# EAGLE board alf_board_v8 (EAGLE 6.3)
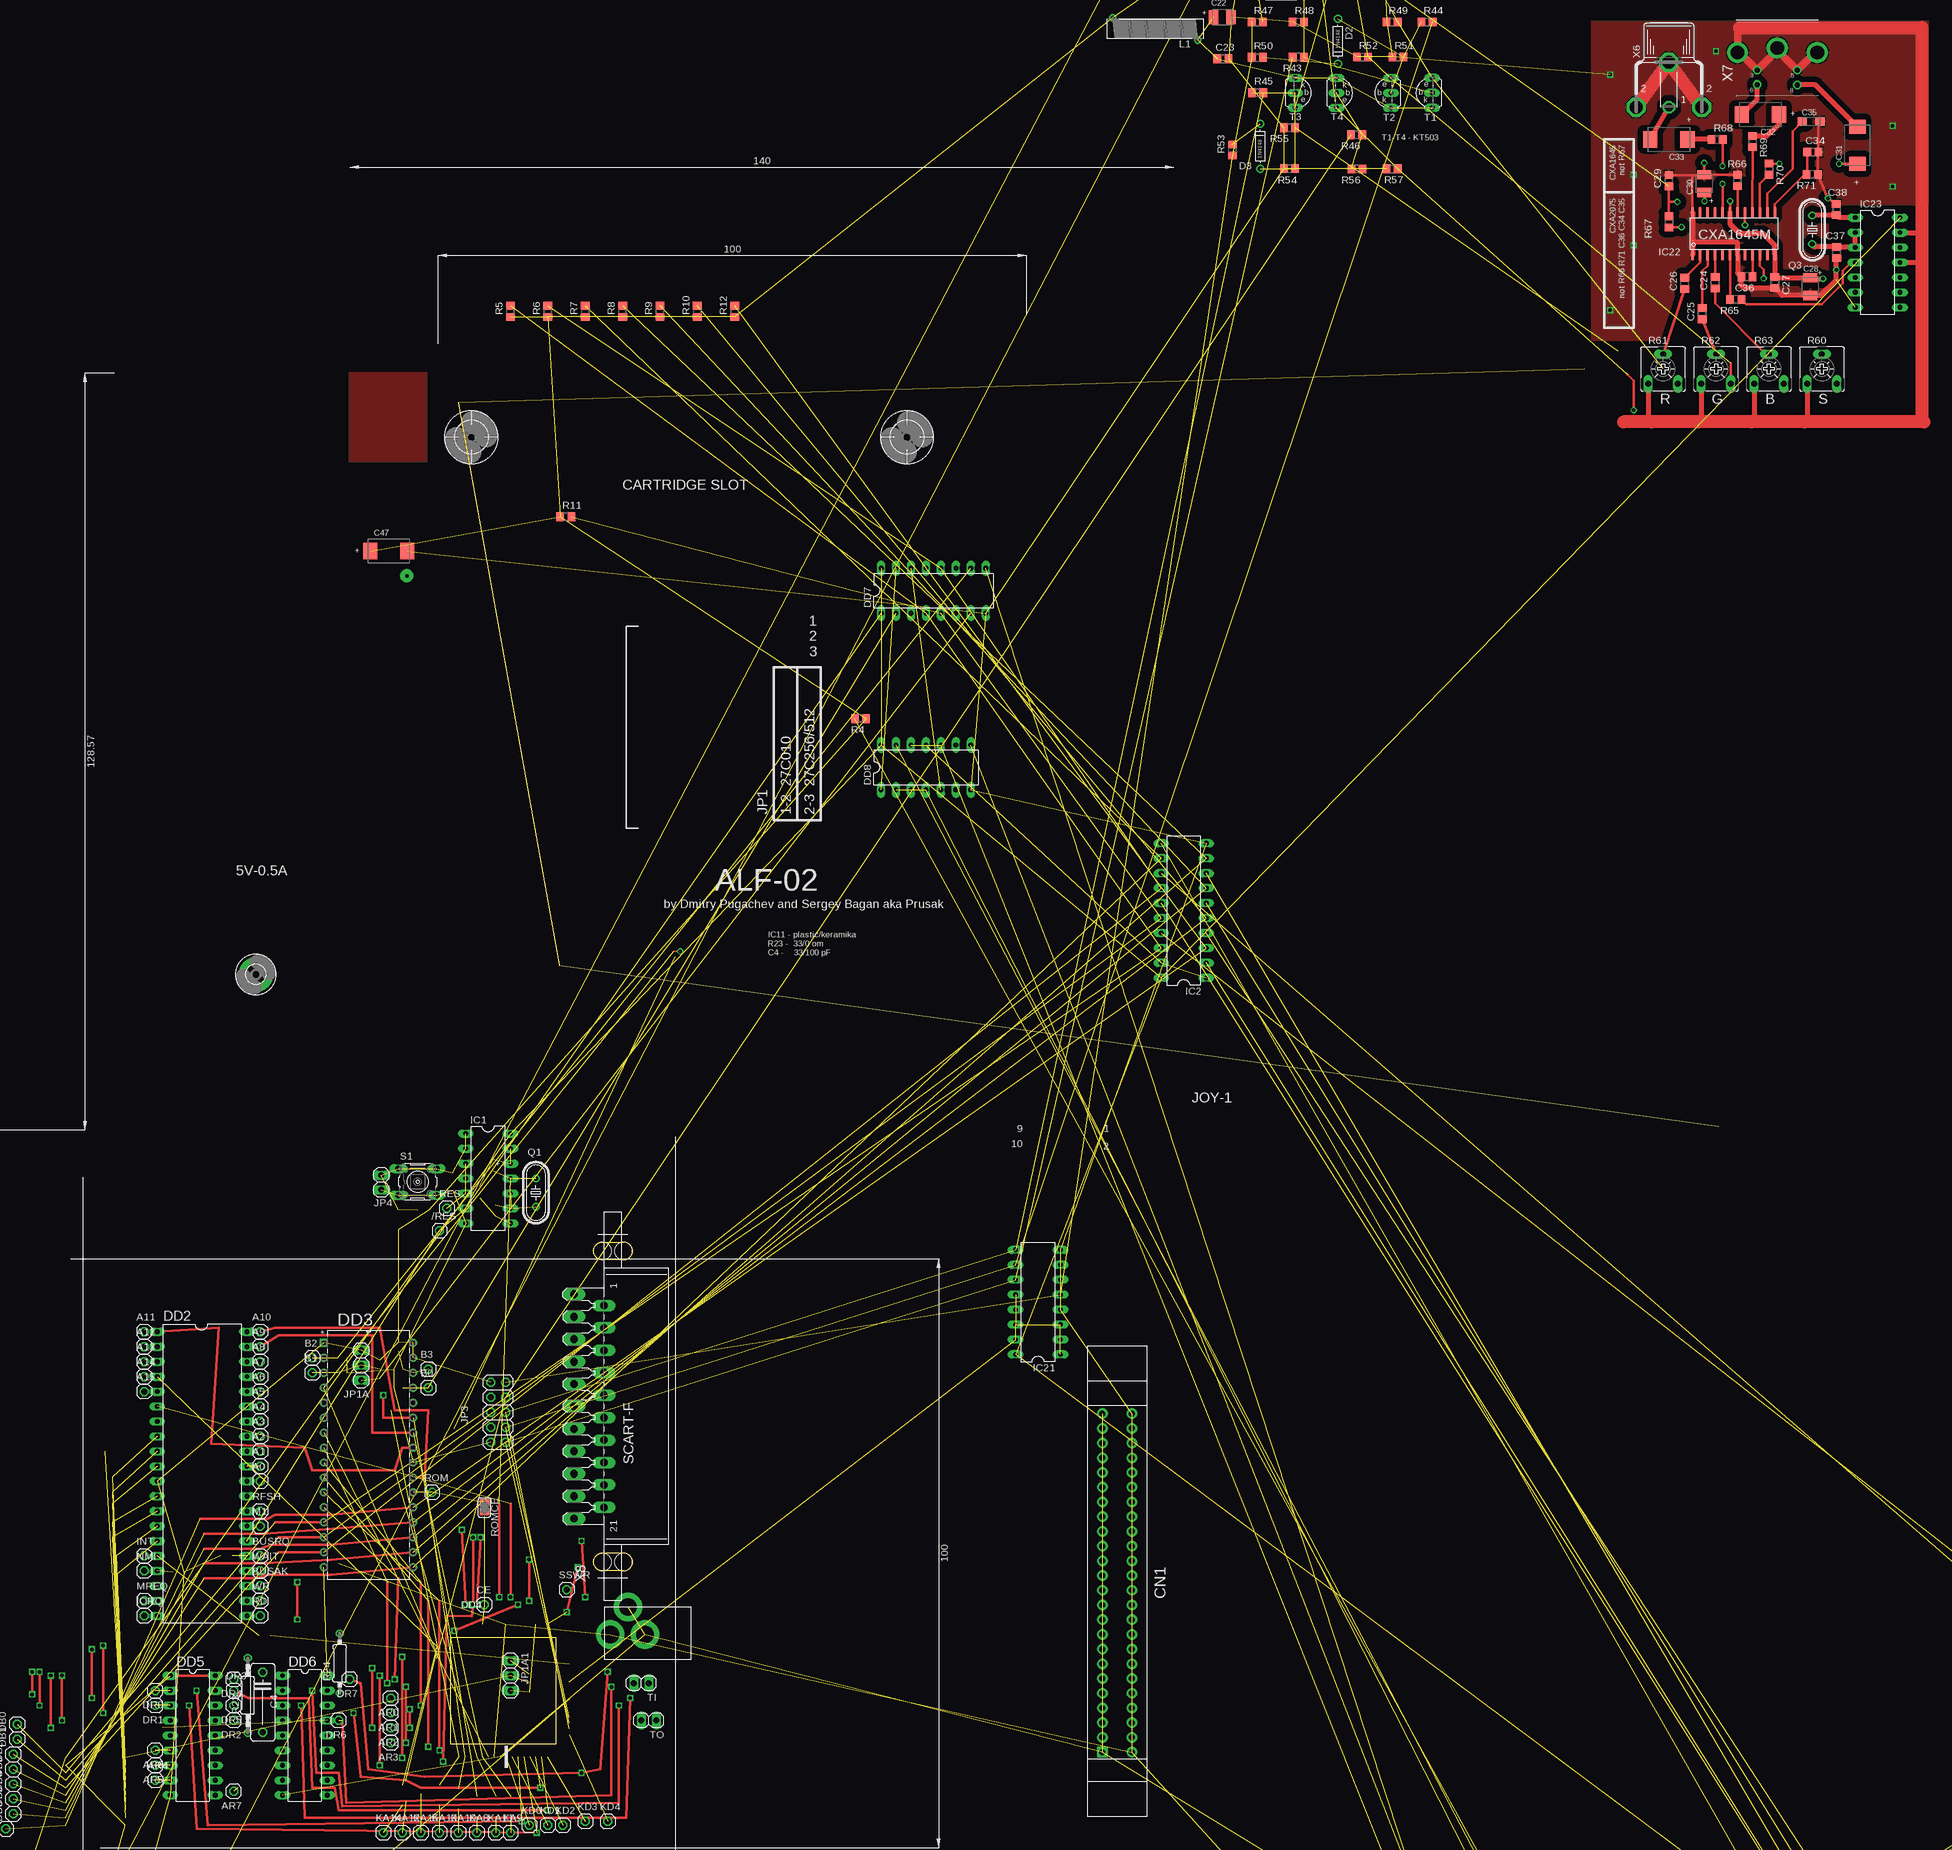
[diagram p5: board, top side]
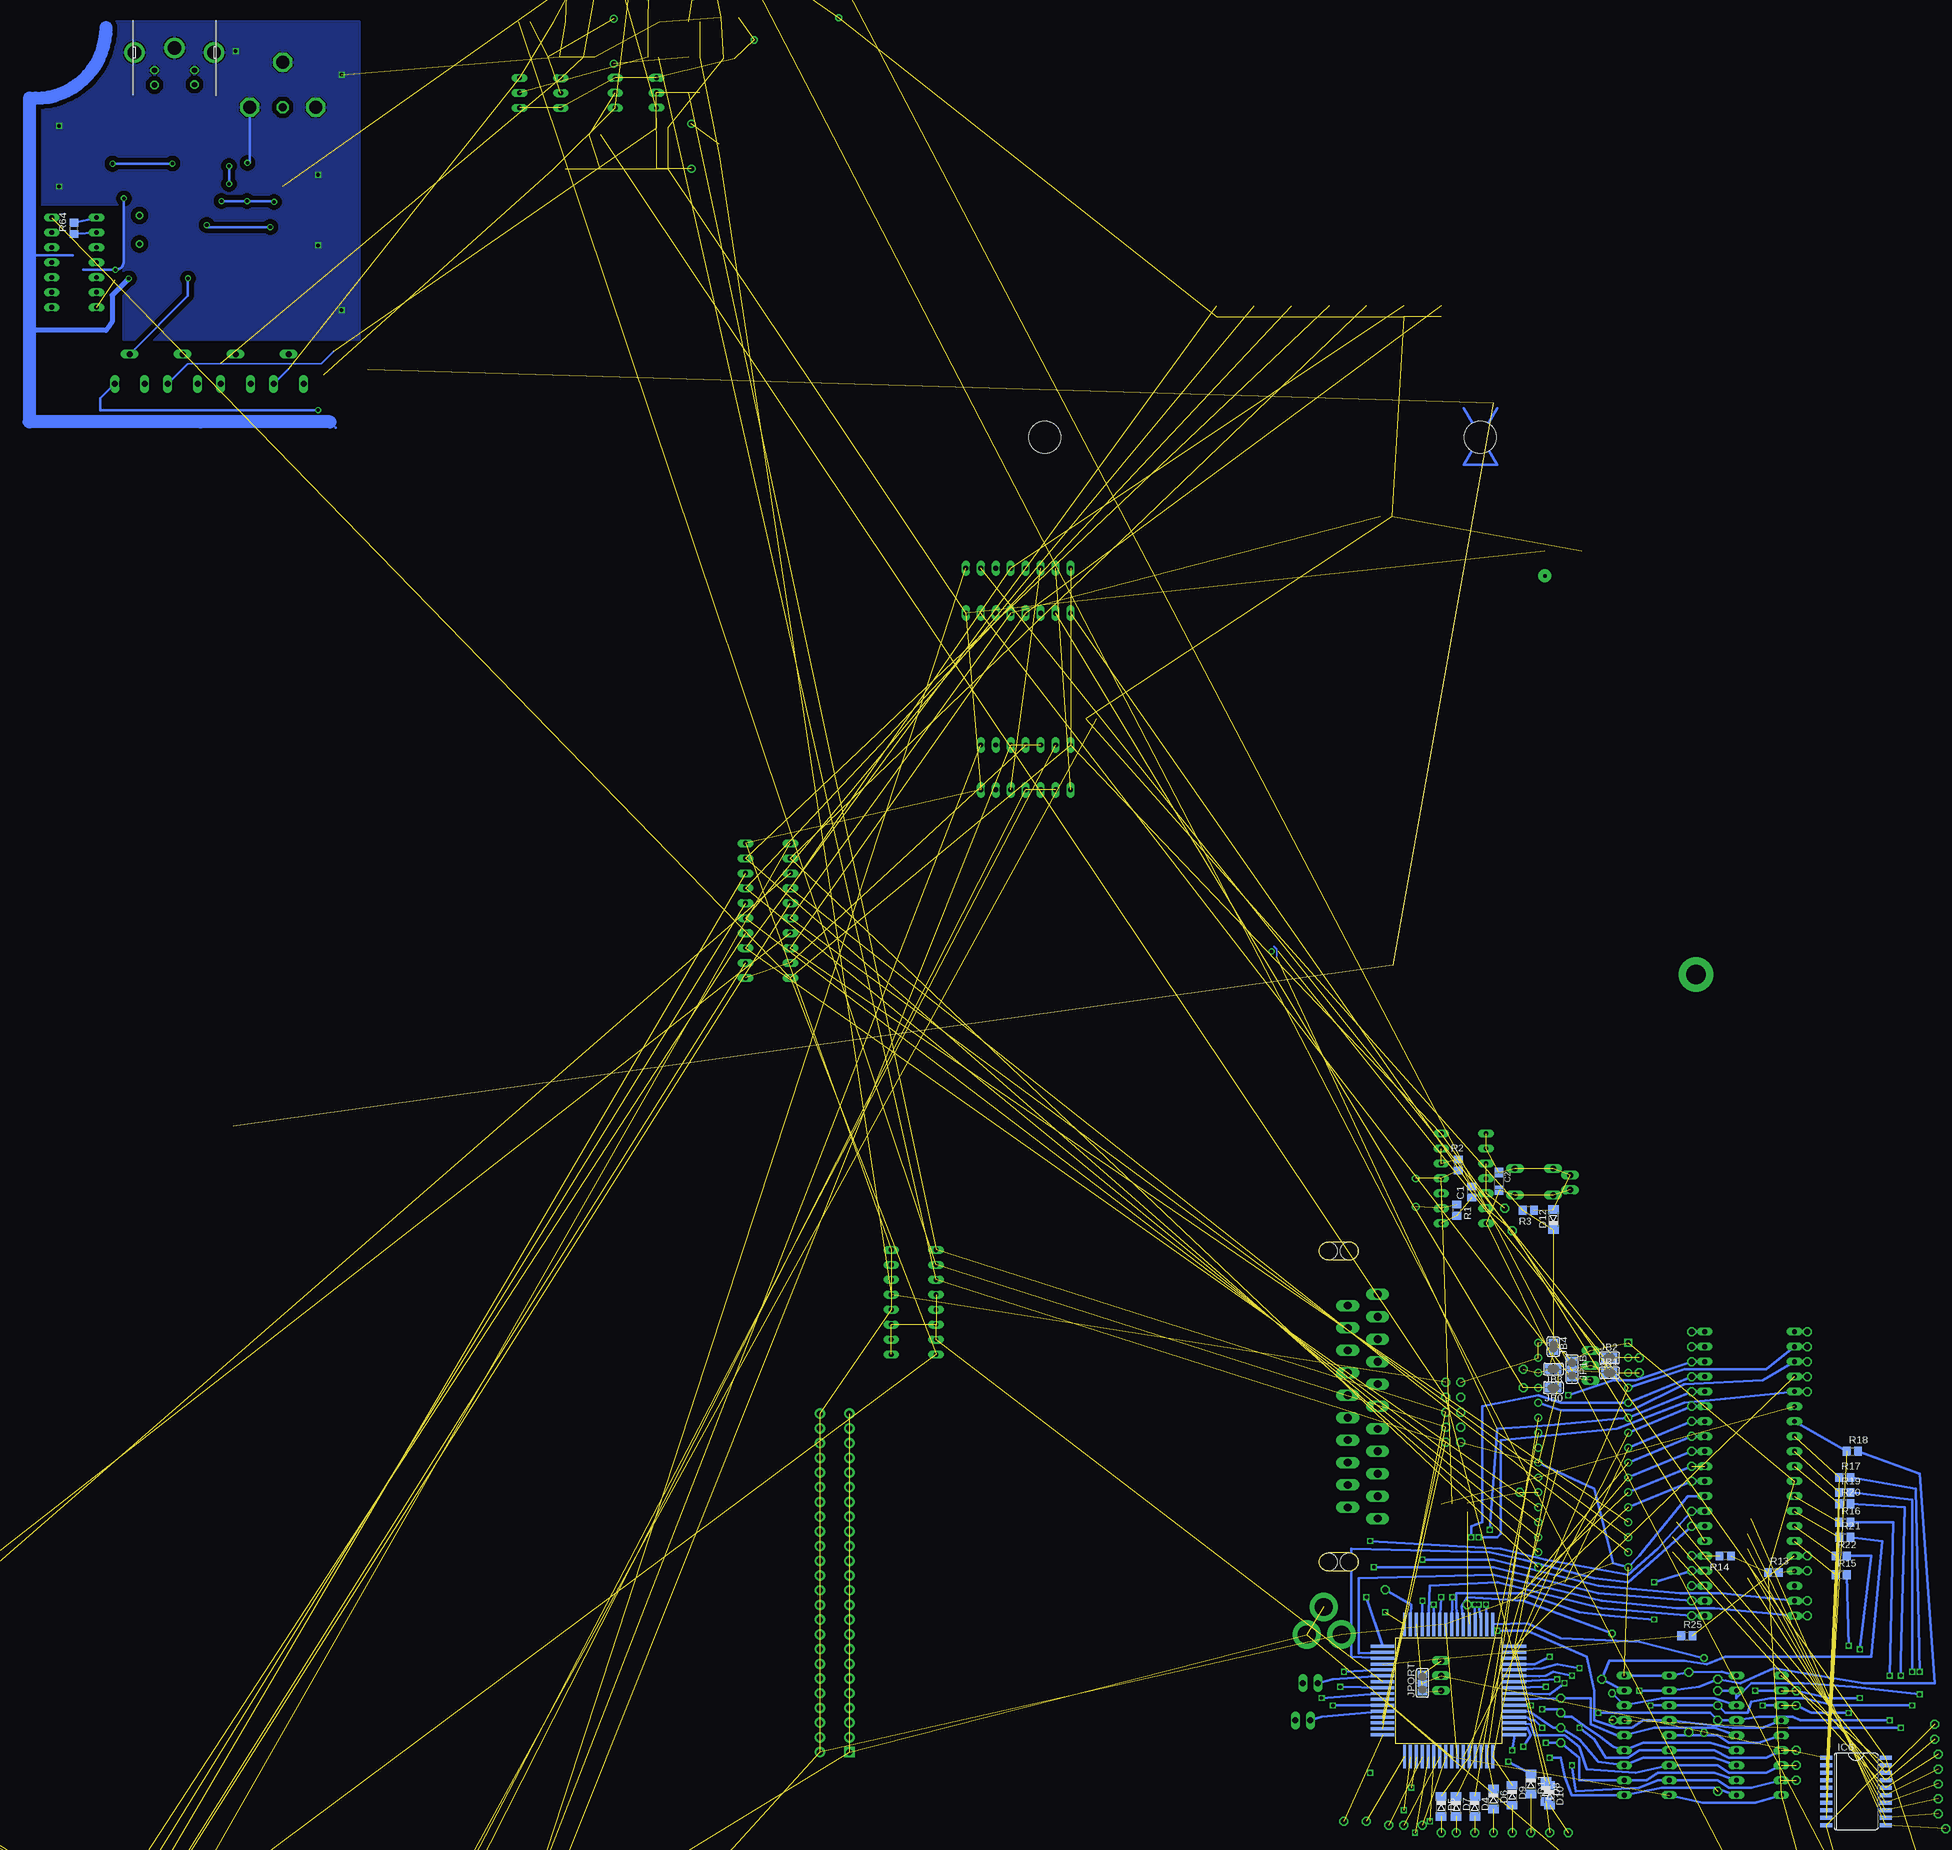
[diagram p6: board, bottom side, seen from below]

Size 215.5 x 233.45 mm. Coordinates in mm from the lower left corner, seen from the top.
Outline: 215.5,104.88 18.53,132.19 1.38,227.74 192.65,233.45
Copper layers (1*16): Top 0.035mm / dielectric 1.5mm / Bottom 0.035mm
Design rules "default *": minimum track width 10mil, minimum drill 24mil, track to track 8mil, track to pad 8mil, pad to pad 8mil, via to via 8mil, smd to smd 8mil, copper to edge 4mil, drill to drill 8mil, minimum pad ring 10mil, minimum via ring 8mil, stop-mask expansion 4mil, vias tented up to drill 24mil, thermal gap 10mil

## Footprints (pad centres in the part's own frame; a part is rotated, then mirrored left to right if it is on the bottom)
1X01 = drill 1.016 octagon: 1 0,0
C0805 = smd 1.3 x 1.5: 1 -0.95,0; 2 0.95,0
SMC_A = smd 1.6 x 1.4: + -1.5,0; - 1.5,0
C102-043X133 = drill 1.016 octagon: 1 -5.08,0; 2 5.08,0
SMC_B = smd 1.6 x 2.4: + -1.5,0; - 1.5,0
SMC_D = smd 2.4 x 2.8: + -3.15,0; - 3.15,0
СНП15-48 = drill 1 pad 1.778 square: 1 29,-2.5 | drill 1 pad 1.778: 2 29,2.5; 3 26.5,-2.5; 4 26.5,2.5; 5 24,-2.5; 6 24,2.5; 7 21.5,-2.5; 8 21.5,2.5; 9 19,-2.5; 10 19,2.5; 11 16.5,-2.5; 12 16.5,2.5; 13 14,-2.5; 14 14,2.5; 15 11.5,-2.5; 16 11.5,2.5; 17 9,-2.5; 18 9,2.5; 19 6.5,-2.5; 20 6.5,2.5; 21 4,-2.5; 22 4,2.5; 23 1.5,-2.5; 24 1.5,2.5; 25 -1,-2.5; 26 -1,2.5; 27 -3.5,-2.5; 28 -3.5,2.5; 29 -6,-2.5; 30 -6,2.5; 31 -8.5,-2.5; 32 -8.5,2.5; 33 -11,-2.5; 34 -11,2.5; 35 -13.5,-2.5; 36 -13.5,2.5; 37 -16,-2.5; 38 -16,2.5; 39 -18.5,-2.5; 40 -18.5,2.5; 41 -21,-2.5; 42 -21,2.5; 43 -23.5,-2.5; 44 -23.5,2.5; 45 -26,-2.5; 46 -26,2.5; 47 -28.5,-2.5; 48 -28.5,2.5
DO-1N4148 = drill 0.9: A -3.81,0; C 3.81,0
SOD80C = smd 1.4 x 1.8: A 1.7,0; C -1.7,0
DIL14 = drill 0.813 long: 1 -7.62,-3.81; 2 -5.08,-3.81; 3 -2.54,-3.81; 4 0,-3.81; 5 2.54,-3.81; 6 5.08,-3.81; 7 7.62,-3.81; 8 7.62,3.81; 9 5.08,3.81; 10 2.54,3.81; 11 0,3.81; 12 -2.54,3.81; 13 -5.08,3.81; 14 -7.62,3.81
DIL40 = drill 0.813 long: 1 -24.13,-7.62; 2 -21.59,-7.62; 3 -19.05,-7.62; 4 -16.51,-7.62; 5 -13.97,-7.62; 6 -11.43,-7.62; 7 -8.89,-7.62; 8 -6.35,-7.62; 9 -3.81,-7.62; 10 -1.27,-7.62; 11 1.27,-7.62; 12 3.81,-7.62; 13 6.35,-7.62; 14 8.89,-7.62; 15 11.43,-7.62; 16 13.97,-7.62; 17 16.51,-7.62; 18 19.05,-7.62; 19 21.59,-7.62; 20 24.13,-7.62; 21 24.13,7.62; 22 21.59,7.62; 23 19.05,7.62; 24 16.51,7.62; 25 13.97,7.62; 26 11.43,7.62; 27 8.89,7.62; 28 6.35,7.62; 29 3.81,7.62; 30 1.27,7.62; 31 -1.27,7.62; 32 -3.81,7.62; 33 -6.35,7.62; 34 -8.89,7.62; 35 -11.43,7.62; 36 -13.97,7.62; 37 -16.51,7.62; 38 -19.05,7.62; 39 -21.59,7.62; 40 -24.13,7.62
DIP254P1524X482-32P = drill 0.838 square: 1 -15.24,38.1 | drill 0.838: 2 -15.24,35.56; 3 -15.24,33.02; 4 -15.24,30.48; 5 -15.24,27.94; 6 -15.24,25.4; 7 -15.24,22.86; 8 -15.24,20.32; 9 -15.24,17.78; 10 -15.24,15.24; 11 -15.24,12.7; 12 -15.24,10.16; 13 -15.24,7.62; 14 -15.24,5.08; 15 -15.24,2.54; 16 -15.24,0; 17 0,0; 18 0,2.54; 19 0,5.08; 20 0,7.62; 21 0,10.16; 22 0,12.7; 23 0,15.24; 24 0,17.78; 25 0,20.32; 26 0,22.86; 27 0,25.4; 28 0,27.94; 29 0,30.48; 30 0,33.02; 31 0,35.56; 32 0,38.1
TQFP64-MF = smd 0.5 x 4 bottom: 1 0.5,-11.225; 2 1.5,-11.225; 3 2.5,-11.225; 4 3.5,-11.225; 5 4.5,-11.225; 6 5.5,-11.225; 7 6.5,-11.225; 8 7.5,-11.225; 25 7.5,11.225; 26 6.5,11.225; 27 5.5,11.225; 28 4.5,11.225; 29 3.5,11.225; 30 2.5,11.225; 31 1.5,11.225; 32 0.5,11.225; 33 -0.5,11.225; 34 -1.5,11.225; 35 -2.5,11.225; 36 -3.5,11.225; 37 -4.5,11.225; 38 -5.5,11.225; 39 -6.5,11.225; 40 -7.5,11.225; 57 -7.5,-11.225; 58 -6.5,-11.225; 59 -5.5,-11.225; 60 -4.5,-11.225; 61 -3.5,-11.225; 62 -2.5,-11.225; 63 -1.5,-11.225; 64 -0.5,-11.225 | smd 4 x 0.5 bottom: 9 11.225,-7.5; 10 11.225,-6.5; 11 11.225,-5.5; 12 11.225,-4.5; 13 11.225,-3.5; 14 11.225,-2.5; 15 11.225,-1.5; 16 11.225,-0.5; 17 11.225,0.5; 18 11.225,1.5; 19 11.225,2.5; 20 11.225,3.5; 21 11.225,4.5; 22 11.225,5.5; 23 11.225,6.5; 24 11.225,7.5; 41 -11.225,7.5; 42 -11.225,6.5; 43 -11.225,5.5; 44 -11.225,4.5; 45 -11.225,3.5; 46 -11.225,2.5; 47 -11.225,1.5; 48 -11.225,0.5; 49 -11.225,-0.5; 50 -11.225,-1.5; 51 -11.225,-2.5; 52 -11.225,-3.5; 53 -11.225,-4.5; 54 -11.225,-5.5; 55 -11.225,-6.5; 56 -11.225,-7.5
DIL18 = drill 0.813 long: 1 -10.16,-3.81; 2 -7.62,-3.81; 3 -5.08,-3.81; 4 -2.54,-3.81; 5 0,-3.81; 6 2.54,-3.81; 7 5.08,-3.81; 8 7.62,-3.81; 9 10.16,-3.81; 10 10.16,3.81; 11 7.62,3.81; 12 5.08,3.81; 13 2.54,3.81; 14 0,3.81; 15 -2.54,3.81; 16 -5.08,3.81; 17 -7.62,3.81; 18 -10.16,3.81
DIL16 = drill 0.813 long: 1 -8.89,-3.81; 2 -6.35,-3.81; 3 -3.81,-3.81; 4 -1.27,-3.81; 5 1.27,-3.81; 6 3.81,-3.81; 7 6.35,-3.81; 8 8.89,-3.81; 9 8.89,3.81; 10 6.35,3.81; 11 3.81,3.81; 12 1.27,3.81; 13 -1.27,3.81; 14 -3.81,3.81; 15 -6.35,3.81; 16 -8.89,3.81
3,3-PAD = drill 3.3 pad 5.842: B3,3 0,0
DIL20 = drill 0.813 long: 1 -11.43,-3.81; 2 -8.89,-3.81; 3 -6.35,-3.81; 4 -3.81,-3.81; 5 -1.27,-3.81; 6 1.27,-3.81; 7 3.81,-3.81; 8 6.35,-3.81; 9 8.89,-3.81; 10 11.43,-3.81; 11 11.43,3.81; 12 8.89,3.81; 13 6.35,3.81; 14 3.81,3.81; 15 1.27,3.81; 16 -1.27,3.81; 17 -3.81,3.81; 18 -6.35,3.81; 19 -8.89,3.81; 20 -11.43,3.81
SO20W = smd 0.66 x 2.032: 1 -5.715,-5.029; 2 -4.445,-5.029; 3 -3.175,-5.029; 4 -1.905,-5.029; 5 -0.635,-5.029; 6 0.635,-5.029; 7 1.905,-5.029; 8 3.175,-5.029; 9 4.445,-5.029; 10 5.715,-5.029; 11 5.715,5.029; 12 4.445,5.029; 13 3.175,5.029; 14 1.905,5.029; 15 0.635,5.029; 16 -0.635,5.029; 17 -1.905,5.029; 18 -3.175,5.029; 19 -4.445,5.029; 20 -5.715,5.029
SOP24 = smd 0.45 x 1.8: 1 -6.97,-3.6; 2 -5.7,-3.6; 3 -4.43,-3.6; 4 -3.16,-3.6; 5 -1.89,-3.6; 6 -0.62,-3.6; 7 0.65,-3.6; 8 1.92,-3.6; 9 3.19,-3.6; 10 4.46,-3.6; 11 5.73,-3.6; 12 7,-3.6; 13 7,3.6; 14 5.73,3.6; 15 4.46,3.6; 16 3.19,3.6; 17 1.92,3.6; 18 0.65,3.6; 19 -0.62,3.6; 20 -1.89,3.6; 21 -3.16,3.6; 22 -4.43,3.6; 23 -5.7,3.6; 24 -6.97,3.6
PJ-102A = drill 3 pad 4.8: RING 0.1,-3.39; RING_SW -4.6,-6.29; TIP 0.1,-9.29
SJ = smd 1.168 x 1.6: 1 -0.762,0; 2 0.762,0
1X03 = drill 1.016 long: 1 -2.54,0; 2 0,0; 3 2.54,0
SJ_2 = smd 1.168 x 1.6: 1 -1.524,0; 2 0,0; 3 1.524,0
2X05 = drill 1.016 octagon: 1 -5.08,-1.27; 2 -5.08,1.27; 3 -2.54,-1.27; 4 -2.54,1.27; 5 0,-1.27; 6 0,1.27; 7 2.54,-1.27; 8 2.54,1.27; 9 5.08,-1.27; 10 5.08,1.27
1X02 = drill 1.016 long: 1 -1.27,0; 2 1.27,0
Z27/24 = drill 0.7 octagon: 1 7.2,-1.9; 2 -7.2,1.9
HC49/S = drill 0.813: 1 -2.413,0; 2 2.413,0
R0805 = smd 1.3 x 1.5: 1 -0.95,0; 2 0.95,0
0207/12 = drill 0.813 octagon: 1 -6.35,0; 2 6.35,0
0207/10 = drill 0.813 octagon: 1 -5.08,0; 2 5.08,0
CA6V = drill 1.016 long: A -2.54,-2.54; E 2.54,-2.54; S 0,2.54
B3F-10XX = drill 1.016 long: 1 -3.251,2.261; 2 3.251,2.261; 3 -3.251,-2.261; 4 3.251,-2.261
TO92-CBE = drill 0.813 long: B 0,0; C -2.54,0; E 2.54,0
5,5 = hole 5.5: 0,0
TOBU3 = drill 1.397 octagon: 1 0,-2.54 | drill 2.21 octagon: 2 5.588,-2.54; 2@1 -5.588,-2.54; 2@2 0,5.08
H5M09RA = drill 1.092: 1 -5.537,1.422; 2 -2.769,1.422; 3 0,1.422; 4 2.769,1.422; 5 5.537,1.422; 6 -4.153,-1.422; 7 -1.384,-1.422; 8 1.384,-1.422; 9 4.153,-1.422 | hole 3.048: -12.497,0; 12.497,0
M15HP = drill 1.016 octagon: 1 -9.601,1.27; 2 -6.858,1.27; 3 -4.115,1.27; 4 -1.372,1.27; 5 1.372,1.27; 6 4.115,1.27; 7 6.858,1.27; 8 9.601,1.27; 9 -8.23,-1.27; 10 -5.486,-1.27; 11 -2.743,-1.27; 12 0,-1.27; 13 2.743,-1.27; 14 5.486,-1.27; 15 8.23,-1.27 | drill 3.302 pad 5.08: G1 -16.662,0; G2 16.662,0
M_DIN4 = drill 0.9 pad 1.422 octagon: 3 -3.4,-3.75; 5 3.4,-3.75; 6 -3.4,-6.2; 8 3.4,-6.25 | drill 2.3 pad 3.5: SH1 6.8,-0.75; SH2 0,0.05; SH3 -6.75,-0.75
SCART-F = drill 1.321 long: 1 19.05,5.08; 2 17.145,0; 3 15.24,5.08; 4 13.335,0; 5 11.43,5.08; 6 9.525,0; 7 7.62,5.08; 8 5.715,0; 9 3.81,5.08; 10 1.905,0; 11 0,5.08; 12 -1.905,0; 13 -3.81,5.08; 14 -5.715,0; 15 -7.62,5.08; 16 -9.525,0; 17 -11.43,5.08; 18 -13.335,0; 19 -15.24,5.08; 20 -17.145,0; 21 -19.05,5.08 | hole 3.023: 26.416,0.254; 26.416,-3.302; -26.416,0.254; -26.416,-3.302

## Placement (x,y rotation side)
/RES  [1X01]  -1.79,87.1 0 top
A0  [1X01]  -32.27,44.56 0 top  (outside the outline)
A1  [1X01]  -32.27,47.1 0 top  (outside the outline)
A2  [1X01]  -32.27,49.64 0 top  (outside the outline)
A3  [1X01]  -32.27,52.18 0 top  (outside the outline)
A4  [1X01]  -32.27,54.72 0 top  (outside the outline)
A5  [1X01]  -32.27,57.26 0 top  (outside the outline)
A6  [1X01]  -32.27,59.8 0 top  (outside the outline)
A7  [1X01]  -32.27,62.34 0 top  (outside the outline)
A8  [1X01]  -32.27,64.88 0 top  (outside the outline)
A9  [1X01]  -32.27,67.42 0 top  (outside the outline)
A10  [1X01]  -32.27,69.96 0 top  (outside the outline)
A11  [1X01]  -51.96,69.96 0 top  (outside the outline)
A12  [1X01]  -51.96,67.42 0 top  (outside the outline)
A13  [1X01]  -51.96,64.88 0 top  (outside the outline)
A14  [1X01]  -51.96,62.34 0 top  (outside the outline)
A15  [1X01]  -51.96,59.8 0 top  (outside the outline)
AR0  [1X01]  -10.05,7.73 180 top  (outside the outline)
AR1  [1X01]  -10.05,5.19 180 top  (outside the outline)
AR2  [1X01]  -10.05,2.65 180 top  (outside the outline)
AR3  [1X01]  -10.05,0.11 180 top  (outside the outline)
AR4  [1X01]  -50.06,-6.24 0 top  (outside the outline)
AR5  [1X01]  -50.06,-3.7 180 top  (outside the outline)
AR6  [1X01]  -50.06,-1.16 180 top  (outside the outline)
AR7  [1X01]  -36.72,-8.15 180 top  (outside the outline)
B0  [1X01]  -3.7,60.43 0 top  (outside the outline)
B1  [1X01]  -23.38,62.97 0 top  (outside the outline)
B2  [1X01]  -23.38,65.51 0 top  (outside the outline)
B3  [1X01]  -3.7,63.61 0 top  (outside the outline)
BUSAK  [1X01]  -32.27,26.78 0 top  (outside the outline)
BUSRQ  [1X01]  -32.27,31.86 0 top  (outside the outline)
C1  68pF  [C0805]  5.07,93.7 90 bottom
C2  10uF 16V  [SMC_A]  0.43,95.48 270 bottom
C4  33/100pF  [C102-043X133]  -31.81,7.01 270 top  (outside the outline)
C5  [C0805]  -87.22,-92.05 180 bottom  (outside the outline)
C6  68pF  [C0805]  -97.09,-126.12 270 top  (outside the outline)
C7  1uF  [SMC_A]  -62.77,-68.52 90 top  (outside the outline)
C8  1uF  [SMC_A]  -80.42,-68.54 90 top  (outside the outline)
C22  100uF  [SMC_B]  131.19,293.25 0 top  (outside the outline)
C23  [C0805]  131.3,286.22 0 top  (outside the outline)
C24  [C0805]  214.91,248.16 90 top  (outside the outline)
C25  [C0805]  212.72,242.91 90 top  (outside the outline)
C26  [C0805]  209.77,248.06 90 top  (outside the outline)
C27  [C0805]  225.06,248.21 270 top  (outside the outline)
C28  47uF  [SMC_B]  231.06,247.51 270 top  (outside the outline)
C29  [C0805]  207.06,265.51 90 top  (outside the outline)
C30  47uF  [SMC_B]  213.06,265.01 90 top  (outside the outline)
C31  220uF  [SMC_D]  239.07,271.51 90 top  (outside the outline)
C32  220uF  [SMC_D]  222.62,276.76 180 top  (outside the outline)
C33  220uF  [SMC_D]  207.06,272.51 180 top  (outside the outline)
C34  [C0805]  231.52,270.36 0 top  (outside the outline)
C35  10uF  [SMC_A]  231.22,275.56 0 top  (outside the outline)
C36  [C0805]  220.31,249.16 180 top  (outside the outline)
C37  33  [C0805]  235.56,253.31 90 top  (outside the outline)
C38  33  [C0805]  235.52,260.61 270 top  (outside the outline)
C39  4n7  [C0805]  309.91,-10.78 0 top  (outside the outline)
C40  [C0805]  345.96,-20.18 270 top  (outside the outline)
C41  50uF  [SMC_B]  339.96,-20.18 270 top  (outside the outline)
C42  [C0805]  304.96,-20.18 270 top  (outside the outline)
C43  50uF  [SMC_B]  297.96,-20.18 270 top  (outside the outline)
C47  220uF  [SMC_D]  -10.44,202.57 0 top  (outside the outline)
CE  [1X01]  5.82,23.6 0 top
CN1  СНП15-48  [СНП15-48]  113.31,27.54 270 top
D1  1N4148  [DO-1N4148]  141.21,296.9 180 top  (outside the outline)
D2  1N4148  [DO-1N4148]  150.83,289.19 270 top  (outside the outline)
D3  1N4148  [DO-1N4148]  137.63,271.35 90 top  (outside the outline)
D4  LL4148  [SOD80C]  4.55,-10.69 270 bottom  (outside the outline)
D5  LL4148  [SOD80C]  10.27,-10.69 270 bottom  (outside the outline)
D6  LL4148  [SOD80C]  1.38,-9.42 270 bottom  (outside the outline)
D7  LL4148  [SOD80C]  7.73,-10.69 270 bottom  (outside the outline)
D8  LL4148  [SOD80C]  -7.51,-8.15 270 bottom  (outside the outline)
D9  LL4148  [SOD80C]  -1.79,-8.78 270 bottom  (outside the outline)
D10  LL4148  [SOD80C]  -8.14,-8.78 270 bottom  (outside the outline)
D11  LL4148  [SOD80C]  -4.97,-6.88 270 bottom  (outside the outline)
D12  LL4148  [SOD80C]  -8.78,89.01 90 bottom  (outside the outline)
DB0  [1X01]  -73.55,3.28 90 top  (outside the outline)
DB1  [1X01]  -73.55,0.74 90 top  (outside the outline)
DB2  [1X01]  -74.19,-1.8 90 top  (outside the outline)
DB3  [1X01]  -74.19,-4.34 90 top  (outside the outline)
DB4  [1X01]  -74.19,-6.88 90 top  (outside the outline)
DB5  [1X01]  -74.19,-9.42 90 top  (outside the outline)
DB6  [1X01]  -74.19,-11.96 90 top  (outside the outline)
DB7  [1X01]  -75.45,-14.5 90 top  (outside the outline)
DD1  LS04/1533LN1  [DIL14]  166.37,-45.41 270 top  (outside the outline)
DD2  Z80  [DIL40]  -42.12,45.83 270 top  (outside the outline)
DD3  27C010  [DIP254P1524X482-32P]  -6.24,29.95 0 top  (outside the outline)
DD4  Т34ВГ1  [TQFP64-MF]  9,9 0 top
DD5  41464/RU11  [DIL18]  -43.7,1.38 270 top  (outside the outline)
DD6  41464/RU11  [DIL18]  -24.66,1.38 270 top  (outside the outline)
DD7  ALS175/1533TM8  [DIL16]  82.12,195.84 0 top
DD8  ALS32/1533LL1  [DIL14]  80.84,165.82 0 top
DR0  [1X01]  -50.06,9 180 top  (outside the outline)
DR1  [1X01]  -50.06,6.46 180 top  (outside the outline)
DR2  [1X01]  -36.72,3.92 180 top  (outside the outline)
DR3  [1X01]  -36.72,9 0 top  (outside the outline)
DR4  [1X01]  -36.72,10.9 180 top  (outside the outline)
DR5  [1X01]  -36.72,6.46 180 top  (outside the outline)
DR6  [1X01]  -18.94,3.92 180 top  (outside the outline)
DR7  [1X01]  -17.04,10.9 180 top  (outside the outline)
H1  MOUNT-PAD-ROUND3.3  [3,3-PAD]  -32.99,130.66 0 top  (outside the outline)
IC1  74HC00N  [DIL14]  6.46,95.99 270 top
IC2  ALS240 / 1533AP3  [DIL20]  124.64,141.49 90 top
IC5  ALS09/1533LI2  [DIL14]  216.75,-86.59 0 top  (outside the outline)
IC6  LS245 / 555AP6  [SO20W]  -60.22,-8.15 270 bottom  (outside the outline)
IC12  YM2149F / AY-3-8910  [DIL40]  -72.47,-126.66 270 top  (outside the outline)
IC13  ALS138/1533ID7  [DIL16]  -109.9,-135.84 270 top  (outside the outline)
IC14  ALS00/1533LA3  [DIL14]  -93.08,-141.3 270 top  (outside the outline)
IC16  ALS93/1533IE5  [DIL14]  -90.26,-116.46 90 top  (outside the outline)
IC17  74HC595  [DIL16]  334.64,-6.84 0 top  (outside the outline)
IC18  74HC595  [DIL16]  231,-37.28 180 top  (outside the outline)
IC19  7493 / 155IE5  [DIL14]  365.22,-11.59 270 top  (outside the outline)
IC20  ALS04/1533LN1  [DIL14]  296.06,-1.3 270 top  (outside the outline)
IC21  ALS251/1533KP15  [DIL16]  99.89,74.98 90 top
IC22  CXA1645  [SOP24]  218.06,256.51 0 top  (outside the outline)
IC23  74HCT04  [DIL14]  242.52,251.61 270 top  (outside the outline)
INT  [1X01]  -51.96,31.86 0 top  (outside the outline)
IORQ  [1X01]  -51.96,21.7 0 top  (outside the outline)
J1  2.1MMJACKTHM  [PJ-102A]  36.5,18.61 270 top
JB0  [SJ]  -8.78,60.43 180 bottom  (outside the outline)
JB1  [SJ]  -18.3,62.97 0 bottom  (outside the outline)
JB2  [SJ]  -18.3,65.51 0 bottom  (outside the outline)
JB3  [SJ]  -8.78,63.61 180 bottom  (outside the outline)
JB4  [SJ]  -8.78,67.42 270 bottom  (outside the outline)
JP1A  [1X03]  -15.1,64.24 90 top  (outside the outline)
JP1A1  [1X03]  10.27,11.54 270 top
JP1B  [SJ_2]  -11.96,63.61 270 bottom  (outside the outline)
JP3  V-TTL-OUT  [2X05]  8.2,56.27 90 top
JP4  RESET  [1X02]  -11.66,95.31 270 top  (outside the outline)
JPORT  [SJ_2]  13.45,10.27 90 bottom
KA8  [1X01]  4.55,-15.13 0 top  (outside the outline)
KA9  [1X01]  10.27,-15.13 0 top  (outside the outline)
KA10  [1X01]  1.38,-15.13 0 top  (outside the outline)
KA11  [1X01]  7.73,-15.13 0 top  (outside the outline)
KA12  [1X01]  -8.14,-15.13 0 top  (outside the outline)
KA13  [1X01]  -1.79,-15.13 0 top  (outside the outline)
KA14  [1X01]  -11.32,-15.13 0 top  (outside the outline)
KA15  [1X01]  -4.97,-15.13 0 top  (outside the outline)
KD0  [1X01]  13.45,-13.86 0 top  (outside the outline)
KD1  [1X01]  16.62,-13.86 0 top  (outside the outline)
KD2  [1X01]  19.16,-13.86 0 top  (outside the outline)
KD3  [1X01]  22.97,-13.23 0 top  (outside the outline)
KD4  [1X01]  26.78,-13.23 0 top  (outside the outline)
L1  220 uH  [Z27/24]  119.8,291.31 180 top  (outside the outline)
M1  [1X01]  -32.27,36.94 0 top  (outside the outline)
MREQ  [1X01]  -51.96,24.24 0 top  (outside the outline)
NMI  [1X01]  -51.96,29.32 0 top  (outside the outline)
PKD0  [1X01]  346.82,12.81 90 top  (outside the outline)
PKD1  [1X01]  331.58,12.81 90 top  (outside the outline)
PKD2  [1X01]  326.5,12.81 90 top  (outside the outline)
PKD3  [1X01]  336.66,12.81 90 top  (outside the outline)
PKD4  [1X01]  341.74,12.81 90 top  (outside the outline)
PKD6  [1X01]  351.9,12.81 90 top  (outside the outline)
Q1  8Mhz  [HC49/S]  14.59,93.59 90 top
Q2  14Mhz  [HC49/S]  -107.53,-118.94 0 top  (outside the outline)
Q3  4,433619Mhz  [HC49/S]  231.41,257.16 270 top  (outside the outline)
R1  510  [R0805]  7.65,90.6 270 bottom
R2  510  [R0805]  7.38,98.28 270 bottom
R3  100k  [R0805]  -4.53,90.58 180 bottom  (outside the outline)
R4  1.6k  [R0805]  69.73,174.1 180 top
R5  2.2k  [R0805]  10.27,243.31 90 top  (outside the outline)
R6  2.2k  [R0805]  16.62,243.31 90 top  (outside the outline)
R7  2.2k  [R0805]  22.97,243.31 90 top  (outside the outline)
R8  2.2k  [R0805]  29.32,243.31 90 top  (outside the outline)
R9  2.2k  [R0805]  35.67,243.31 90 top  (outside the outline)
R10  2.2k  [R0805]  42.02,243.31 90 top  (outside the outline)
R11  2.2k  [R0805]  19.65,208.41 0 top
R12  2.2k  [R0805]  48.37,243.31 90 top  (outside the outline)
R13  10k  [R0805]  -46.17,29.05 0 bottom  (outside the outline)
R14  10k  [R0805]  -37.99,31.86 180 bottom  (outside the outline)
R15  1k  [R0805]  -57.67,28.68 0 bottom  (outside the outline)
R16  1k  [R0805]  -58.31,37.57 0 bottom  (outside the outline)
R17  1k  [R0805]  -58.31,45.19 0 bottom  (outside the outline)
R18  1k  [R0805]  -59.58,49.64 0 bottom  (outside the outline)
R19  1k  [R0805]  -58.31,42.65 0 bottom  (outside the outline)
R20  1k  [R0805]  -58.31,40.75 0 bottom  (outside the outline)
R21  1k  [R0805]  -58.31,35.03 0 bottom  (outside the outline)
R22  1k  [R0805]  -57.67,31.86 0 bottom  (outside the outline)
R23  33/0  [0207/12]  -34.38,8.16 90 top  (outside the outline)
R24  33  [0207/10]  -18.75,13.61 90 top  (outside the outline)
R25  300  [R0805]  -31.48,18.28 0 bottom  (outside the outline)
R26  510  [R0805]  -89.58,-126.69 270 top  (outside the outline)
R27  510  [R0805]  -84.66,-130.25 270 top  (outside the outline)
R28  2.2k  [R0805]  -68.58,-63.93 0 top  (outside the outline)
R29  1k  [R0805]  -63.22,-75.25 270 top  (outside the outline)
R30  1k  [R0805]  -57.81,-75.24 270 top  (outside the outline)
R31  15k  [R0805]  -68.5,-69.34 270 top  (outside the outline)
R32  2.2k  [R0805]  -68.5,-75.29 270 top  (outside the outline)
R33  15k  [R0805]  -74.5,-69.34 270 top  (outside the outline)
R34  2.2k  [R0805]  -74.5,-75.29 270 top  (outside the outline)
R35  1k  [R0805]  -85.41,-75.29 270 top  (outside the outline)
R36  2.2k  [R0805]  -74.61,-63.92 180 top  (outside the outline)
R37  1k  [R0805]  -79.97,-75.25 270 top  (outside the outline)
R38  1k  [R0805]  -70.58,-93.69 270 top  (outside the outline)
R39  1.5k  [R0805]  304.96,-11.18 90 top  (outside the outline)
R40  10k  [R0805]  347.96,6.82 0 top  (outside the outline)
R41  1k  [R0805]  343.97,0.81 90 top  (outside the outline)
R42  10k  [R0805]  322.96,6.82 0 top  (outside the outline)
R43  1k  [R0805]  144.12,286.49 180 top  (outside the outline)
R44  1k  [R0805]  166,292.47 0 top  (outside the outline)
R45  1k  [R0805]  137.19,280.47 0 top  (outside the outline)
R46  1.5k  [R0805]  154.02,273.28 180 top  (outside the outline)
R47  3k3  [R0805]  137.15,292.47 0 top  (outside the outline)
R48  3k3  [R0805]  144.09,292.47 0 top  (outside the outline)
R49  200  [R0805]  160.05,292.47 0 top  (outside the outline)
R50  3k3  [R0805]  137.15,286.47 0 top  (outside the outline)
R51  3k3  [R0805]  161.05,286.51 0 top  (outside the outline)
R52  200  [R0805]  155,286.51 0 top  (outside the outline)
R53  3k3  [R0805]  132.91,270.72 90 top  (outside the outline)
R54  3k3  [R0805]  142.59,267.56 0 top  (outside the outline)
R55  200  [R0805]  142.59,274.51 0 top  (outside the outline)
R56  2k  [R0805]  154.06,267.49 180 top  (outside the outline)
R57  200  [R0805]  160.05,267.51 0 top  (outside the outline)
R58  100  [R0805]  139.68,311.16 90 bottom  (outside the outline)
R60  [CA6V]  233.06,233.51 0 top  (outside the outline)
R61  [CA6V]  206.06,233.51 0 top
R62  [CA6V]  215.06,233.51 0 top
R63  [CA6V]  224.06,233.51 0 top  (outside the outline)
R64  4.7M  [R0805]  242.52,257.41 90 bottom  (outside the outline)
R65  1.6k  [R0805]  218.41,245.31 180 top  (outside the outline)
R66  16k  [R0805]  218.72,265.56 90 top  (outside the outline)
R67  2.4k  [R0805]  207.06,258.51 270 top  (outside the outline)
R68  75  [R0805]  215.27,272.51 0 top  (outside the outline)
R69  75  [R0805]  221.27,272.16 270 top  (outside the outline)
R70  75  [R0805]  224.06,267.46 270 top  (outside the outline)
R71  47k  [R0805]  231.41,266.56 180 top  (outside the outline)
RD  [1X01]  -32.27,21.7 0 top  (outside the outline)
RES  [1X01]  -0.52,90.91 0 top
RFSH  [1X01]  -32.27,39.48 0 top  (outside the outline)
ROM  [1X01]  -3.06,42.65 0 top  (outside the outline)
ROMCE  [SJ]  5.82,40.11 270 top
S1  RESET  [B3F-10XX]  -5.51,95.42 0 top
SSWR  [1X01]  19.79,26.14 0 top
T1  [TO92-CBE]  166.84,280.42 90 top  (outside the outline)
T2  [TO92-CBE]  159.84,280.39 90 top  (outside the outline)
T3  [TO92-CBE]  143.58,280.44 270 top  (outside the outline)
T4  [TO92-CBE]  150.58,280.41 270 top  (outside the outline)
TI  [1X02]  32.5,10.27 180 top
TO  [1X02]  33.77,3.92 180 top
U$2  [5,5]  3.61,221.92 0 top
U$3  [5,5]  77.62,221.92 0 top
WAIT  [1X01]  -32.27,29.32 0 top  (outside the outline)
WR  [1X01]  -32.27,24.24 0 top  (outside the outline)
X1  RCA_L  [TOBU3]  113.68,305.2 0 top  (outside the outline)
X2  RCA_R  [TOBU3]  128.91,305.2 0 top  (outside the outline)
X3  RGB-OUT  [H5M09RA]  153.21,303.27 180 top  (outside the outline)
X4  JOY-1  [M15HP]  301.49,-25.59 0 top  (outside the outline)
X5  JOY-2  [M15HP]  342.85,-25.59 0 top  (outside the outline)
X6  Video  [TOBU3]  207.06,280.51 0 top  (outside the outline)
X7  s-video  [M_DIN4]  225.47,288.01 0 top  (outside the outline)
X8  SCART-F  [SCART-F]  26.14,57.26 90 top

## Tracks (layer width: path | path; a pad name or v marks a point on that pad's centre or on a via)
1IC8  (1 unrouted)
8M  (via drill 0.6)  (3 unrouted)
  Top 0.406: v8.36,24.88 8.36,40.75
  Bottom 0.406: DD4.33 v8.36,24.88
!BUSAK
  Bottom 0.406: DD2.23 BUSAK.1
!BUSRQ  (1 unrouted)
  Bottom 0.406: DD2.25 BUSRQ.1
!CAS
  Bottom 0.406: R24.2 -3.68,24.24 5.82,24.88 6.73,23.33 DD4.35
!CE  (2 unrouted)
!INT  (1 unrouted)
  Bottom 0.406: DD2.16 INT.1
!IORQ
  Bottom 0.406: IORQ.1 DD2.20 -36.09,22.97 -29.73,22.97 -17.04,24.24 1.38,28.68 24.24,28.05 24.24,15.35 DD4.23
!M1
  Bottom 0.406: DD2.27 M1.1 -21.48,27.41 -15.77,28.05 -3.7,31.22 2.02,32.49 25.51,33.13 25.51,14.71 DD4.22
!MREQ  (via drill 0.6)
  Top 0.406: v13.45,31.22 v13.45,24.24
  Bottom 0.406: MREQ.1 DD2.19 -37.36,25.51 -30.37,25.51 -16.4,26.78 1.38,31.22 v13.45,31.22 | v13.45,24.24 DD4.28
!NMI  (1 unrouted)
  Bottom 0.406: DD2.17 NMI.1
!RAS
  Bottom 0.406: R23.2 -23.38,17.25 -10.05,17.89 -4.34,20.43 DD4.40
!RD
  Bottom 0.406: DD2.21 RD.1 -17.04,22.97 0.75,27.41 12.18,26.78 DD4.29
!RES  (3 unrouted)
!RFSH  (via drill 0.6)
  Top 0.406: v22.33,34.4 v22.97,24.88
  Bottom 0.406: DD2.28 RFSH.1 -26.56,33.13 -21.48,28.68 -7.51,31.22 0.11,33.13 v22.33,34.4 | v22.97,24.88 DD4.24
!ROM  (2 unrouted)
!SSRD  (2 unrouted)
!SSWR
  Bottom 0.406: SSWR.1 15.35,23.6 DD4.26
!WAIT  (via drill 0.6)
  Top 0.406: v-25.93,27.41 v-25.93,21.06
  Bottom 0.406: DD2.24 WAIT.1 v-25.93,27.41 | v-25.93,21.06 -18.3,21.7 -13.22,22.33 -3.7,25.51 7.73,25.51 7.73,23.6 DD4.34
!WE  (via drill 0.6)
  Top 0.406: v0.75,19.16 v11.54,23.6
  Bottom 0.406: DD5.4 -44.34,2.65 -39.26,2.65 DD6.4 -24.02,3.92 -22.12,2.65 -19.57,2.65 -15.77,3.92 -15.77,9 -14.5,14.71 -4.34,19.16 v0.75,19.16 | v11.54,23.6 DD4.30
!WR  (via drill 0.6)  (1 unrouted)
  Top 0.406: v21.7,29.95 v19.79,22.33
  Bottom 0.406: DD2.22 WR.1 -16.4,25.51 1.38,29.95 v21.7,29.95
+5V  (via drill 0.6, 0.6 pad 0.25)  (44 unrouted)
  Top 0.406: R67.1 207.06,261.91 | 207.06,261.91 C29.1 | C30.+ 213.12,263.51 v213.12,262.01 | v208.52,261.91 207.06,261.91 | v217.47,262.01 217.44,262.01 IC22.19 | C27.1 225.22,249.01
  Top 0.813: IC22.19 217.44,258.13 219.06,256.51 223.06,256.51 225.06,254.51 IC22.12 C27.1 | 225.22,249.01 C28.+ 231.22,248.86 v233.27,248.86
  Bottom 0.406: v208.52,261.91 208.52,262.01 v213.12,262.01 v217.47,262.01 | 199.06,224.51 198.06,223.51 | 242.77,252.81 250.07,252.81 | DD5.9 -43.07,-10.05 -34.18,-10.05 DD6.9
  Bottom 0.813: v233.27,248.86 236.06,246.06 236.06,241.51 237.06,240.06 250.07,240.06
  Bottom 1.676: 250.41,224.51 250.07,224.51
  Bottom 2.184: 237.06,291.51 arc90 249.07,279.51 250.07,279.51 250.07,252.81 250.07,240.06 250.07,224.51 221.06,224.51 210.64,224.56 199.06,224.51
_1IC8  (2 unrouted)
_!CE  (2 unrouted)
_!SSRD  (1 unrouted)
_A1  (1 unrouted)
A0  (via drill 0.6)  (1 unrouted)
  Top 0.406: v-9.41,10.9 -8.78,28.05
  Bottom 0.406: DD2.30 A0.1 DD3.12 | DD4.47 v-9.41,10.9
A1  (via drill 0.6)  (2 unrouted)
  Top 0.406: v-1.79,-1.16 -1.79,24.24
  Bottom 0.406: DD3.11 A1.1 | DD4.56 v-1.79,-1.16
A2  (via drill 0.6)  (1 unrouted)
  Top 0.406: v-3.7,-0.53 -3.7,24.24
  Bottom 0.406: DD2.32 A2.1 DD3.10 | DD4.55 -4.34,2.65 -4.97,1.38 v-3.7,-0.53
A3  (via drill 0.6)  (1 unrouted)
  Top 0.406: v-4.97,6.46 -4.97,27.41
  Bottom 0.406: DD2.33 A3.1 DD3.9 | DD4.51 v-4.97,6.46
A4  (via drill 0.6)  (1 unrouted)
  Top 0.406: v-10.69,10.27 -10.69,27.41
  Bottom 0.406: DD2.34 A4.1 DD3.8 | DD4.49 -8.14,8.36 v-10.69,10.27
A5  (1 unrouted)
  Bottom 0.406: DD2.35 A5.1 DD3.7
A6  (via drill 0.6)  (1 unrouted)
  Top 0.406: v2.02,36.3 v2.65,23.6
  Bottom 0.254: 38.72,135.44 38.22,134.94 38.22,133.69
  Bottom 0.406: DD2.36 A6.1 DD3.6 -8.14,54.08 0.75,53.45 v2.02,36.3 | v2.65,23.6 DD4.39
A7  (via drill 0.6)
  Top 0.406: v4.55,23.6 v5.19,35.03
  Bottom 0.406: DD2.37 A7.1 DD3.5 -10.05,57.89 -6.24,59.16 3.29,57.26 3.29,37.57 5.19,36.94 v5.19,35.03 | DD4.37 v4.55,23.6
A8  (via drill 0.6)  (2 unrouted)
  Top 0.406: v-11.32,59.16 -11.32,55.35 DD3.27
  Bottom 0.406: DD2.38 A8.1 -22.75,61.7 -18.94,61.7 v-11.32,59.16
A9  (2 unrouted)
  Top 0.406: DD3.26 -13.22,52.81 -13.22,69.32 -29.1,69.32 A9.1
  Bottom 0.406: DD2.39 A9.1
A10  (2 unrouted)
  Top 0.406: A10.1 -29.73,70.59 -11.96,70.59 -9.41,56.62 -3.7,56.62 -4.34,45.19 DD3.23
  Bottom 0.406: A10.1 DD2.40
A11  (2 unrouted)
  Top 0.406: DD2.1 -39.26,70.59 -40.53,50.91 -24.66,50.27 -23.38,46.46 -9.41,46.46 -8.14,50.27 DD3.25
  Bottom 0.406: A11.1 DD2.1
A12  (via drill 0.61)  (3 unrouted)
  Top 0.254: 37.97,134.57 v39.09,134.57
  Bottom 0.406: A12.1 DD2.2 -44.98,63.61 -31.01,63.61 DD3.4
A13  (2 unrouted)
  Bottom 0.406: A13.1 DD2.3 -44.34,61.7 -31.01,61.07 -22.12,56.62 -10.05,56.62 DD3.28
A14  (2 unrouted)
  Bottom 0.406: A14.1 DD2.4
A15  (via drill 0.6)
  Top 0.406: v3.92,35.03 v3.92,23.6 3.68,21.65 -0.52,21.7 v-1.16,-3.07
  Bottom 0.406: A15.1 DD2.5 -37.99,58.53 -31.01,57.89 -19.57,53.45 0.11,51.54 0.11,35.67 0.75,35.03 v3.92,35.03 | v3.92,23.6 DD4.38 | D11.C v-1.16,-3.07
AR0
  Bottom 0.406: -9.73,7.41 AR0.1 | AR0.1 -15.13,7.73 -15.13,3.28 -19.57,1.38 DD6.14 -25.93,2.65 -36.09,2.65 DD5.14 | DD4.50 AR0.1
AR1  (via drill 0.6)
  Top 0.406: v-6.88,5.82 v-6.88,2.65
  Bottom 0.406: v-6.88,5.82 -9.41,5.82 AR1.1 -10.69,4.55 -11.96,4.55 -14.5,2.65 -16.4,1.38 -18.94,-0.53 DD6.13 -24.02,0.11 -35.45,0.11 DD5.13 | v-6.88,2.65 -5.61,3.92 -4.97,3.92 -4.48,4.41 DD4.53
AR2
  Bottom 0.406: DD5.12 -36.09,-2.43 -24.02,-2.43 DD6.12 -16.4,-3.07 -13.22,0.74 AR2.1 -8.78,2.65 -4.75,5.41 DD4.52
AR3  (via drill 0.6)
  Top 0.406: v-7.51,9.63 v-7.51,0.11
  Bottom 0.406: -7.29,9.41 v-7.51,9.63 DD4.48 | v-7.51,0.11 AR3.1 -13.22,-2.43 -13.22,-6.24 DD6.11 -24.66,-6.24 -26.56,-4.97 -36.09,-4.97 DD5.11
AR4  (via drill 0.6)  (1 unrouted)
  Top 0.406: v-11.96,-3.7 v-11.96,11.54
  Bottom 0.406: DD5.8 -42.44,-7.51 -38.62,-7.51 -36.72,-6.24 DD6.8 -26.56,-6.24 -23.38,-7.51 -12.59,-8.15 v-11.96,-3.7 | v-11.96,11.54 -8.78,12.17 -7.51,11.54 -6.37,11.41 DD4.46
AR5  (1 unrouted)
  Bottom 0.406: DD5.7 -44.98,-4.97 -38.62,-4.97 -36.72,-3.7 DD6.7 -22.75,-4.97 -14.5,-4.34 -13.22,-0.53 -10.69,1.38 -5.61,1.38 -4.97,3.28 DD4.54
AR6  (via drill 0.6)  (1 unrouted)
  Top 0.406: v-13.22,2.65 v-13.22,12.81
  Bottom 0.406: DD5.6 -44.98,-2.43 -38.62,-2.43 -36.09,-1.16 DD6.6 -23.38,-1.16 -21.48,-2.43 -17.67,-2.43 -15.77,0.74 v-13.22,2.65 | v-13.22,12.81 -9.41,13.44 -6.88,12.81 DD4.45
AR7  (via drill 0.6)  (1 unrouted)
  Top 0.406: v-8.14,-2.43 v-8.14,14.71
  Bottom 0.406: DD5.10 -36.09,-7.51 -27.2,-7.51 DD6.10 -11.96,-8.78 -10.69,-5.61 -10.05,-2.43 v-8.14,-2.43 | v-8.14,14.71 -6.31,13.83 -5.61,13.44 DD4.44
B  (3 unrouted)
B0  (3 unrouted)
B1  (4 unrouted)
B2  (3 unrouted)
B3  (3 unrouted)
BEEPER  (2 unrouted)
CA  (1 unrouted)
CAS_RAM
  Bottom 0.406: DD5.16 -36.09,7.73 -27.2,7.73 DD6.16 -18.77,8.53 R24.1
CB  (2 unrouted)
CC  (1 unrouted)
CLC2  (1 unrouted)
CLK  (via drill 0.6)  (1 unrouted)
  Top 0.406: v10.27,24.88 10.27,40.75
  Bottom 0.406: DD4.31 v10.27,24.88
D0  (2 unrouted)
D1  (2 unrouted)
D2  (2 unrouted)
D3  (2 unrouted)
D4  (1 unrouted)
  Bottom 0.406: DD2.7 R18.1
D5  (2 unrouted)
D6  (2 unrouted)
D7  (2 unrouted)
DB0  (5 unrouted)
  Top 0.406: DD3.13 -29.73,37.57
DB1  (5 unrouted)
  Top 0.406: DD3.14 -29.1,35.03
DB2  (5 unrouted)
  Top 0.406: DD3.15 -29.1,32.49
DB3  (4 unrouted)
  Top 0.406: DD3.17 -20.21,28.68 -31.01,28.68 -32.91,28.05 -41.8,28.05
DB4  (4 unrouted)
  Top 0.406: DD3.18 -20.21,31.22 -31.64,30.59 -41.8,30.59
DB5  (4 unrouted)
  Top 0.406: DD3.19 -20.21,33.76 -30.37,33.76 -32.27,33.13 -41.8,33.13
DB6  (4 unrouted)
  Top 0.406: DD3.20 -22.12,36.3 -31.64,35.67 -41.8,35.67
DB7  (5 unrouted)
  Top 0.406: DD3.21 -20.21,38.84 -29.73,38.84 -31.01,38.21 -42.44,38.21
DD7Q2  (2 unrouted)
DR0  (via drill 0.6)  (2 unrouted)
  Top 0.406: v-43.07,9 -41.16,-13.86 v12.18,-13.23 | v-60.85,15.98 v-60.85,7.73
  Bottom 0.406: DD5.2 v-43.07,9 | R22.2 -62.75,31.86 v-60.85,15.98 | v-60.85,7.73 -55.77,7.73 DR0.1
DR1  (via drill 0.6)  (2 unrouted)
  Top 0.406: v-44.34,6.46 -43.07,-14.5 v14.71,-15.13 | v-58.94,16.62 v-58.94,5.19
  Bottom 0.406: DD5.3 v-44.34,6.46 | R15.2 v-58.94,16.62 | v-58.94,5.19 -52.59,5.19 DR1.1
DR2  (via drill 0.6)  (1 unrouted)
  Top 0.406: v-16.4,5.19 -15.13,-5.61 -7.51,-6.24 -4.97,-7.51 v15.35,-7.51 | v-65.93,11.54 v-65.93,3.92
  Bottom 0.406: v-16.4,5.19 -35.45,5.19 DR2.1 DD5.15 -43.7,4.55 -49.42,4.55 -50.69,3.92 v-65.93,3.92 | R16.2 -66.56,37.57 v-65.93,11.54
DR3  (via drill 0.6)  (1 unrouted)
  Top 0.406: DR3.1 -34.18,7.73 -24.02,7.73 -23.38,-7.51 -19.57,-7.51 -18.94,-11.32 v16.62,-11.32 | v-71.01,12.17 v-71.01,8.36
  Bottom 0.406: R17.2 -70.38,43.29 v-71.01,12.17 | v-71.01,8.36 -59.58,9.63 -51.33,10.27 -42.44,10.27 -39.89,7.73 DD5.17 DR3.1
DR4  (via drill 0.6)
  Top 0.406: v-23.38,9 -22.75,-4.97 -18.94,-4.97 -18.3,-10.69 28.68,-10.05 v28.68,6.46
  Bottom 0.406: v-23.38,9 DD6.2 -33.55,9.63 DR4.1 -40.53,10.27 -46.25,12.81 -61.48,10.27 -73.55,10.27 -71.01,45.83 R18.2 | DD4.14 v28.68,6.46
DR5  (via drill 0.6)
  Top 0.406: v-25.29,6.46 -24.66,-12.59 29.96,-12.59 v30.59,7.73 | v-69.74,12.17 v-69.74,6.46
  Bottom 0.406: v-25.29,6.46 DD6.3 DR5.1 -37.99,5.19 -41.8,5.19 -42.44,7.09 -45.61,7.73 -51.33,7.73 -56.41,6.46 v-69.74,6.46 | R19.2 -69.74,41.38 v-69.74,12.17 | DD4.16 v30.59,7.73
DR6  (via drill 0.6)  (2 unrouted)
  Top 0.406: DD6.15 -18.3,3.92 -17.67,-10.05 27.42,-8.78 v27.42,9.63 | v-67.83,11.54 v-67.83,2.65
  Bottom 0.406: R20.2 -68.47,40.11 -67.83,14.08 v-67.83,11.54 | v-67.83,2.65 -48.78,2.65 | v27.42,9.63 DD4.17
DR7  (via drill 0.6)
  Top 0.406: v26.78,12.17 25.51,-4.34 v22.33,-4.97 -4.34,-5.61 -13.86,-4.34 -15.13,10.27 DR7.1
  Bottom 0.406: DD6.17 DR7.1 -18.3,14.08 -31.01,14.08 -34.81,13.44 -37.99,14.71 -62.75,14.71 -64.66,34.4 R21.2 | v26.78,12.17 DD4.20
G  (3 unrouted)
GND  (via drill 0.6, 0.6 pad 0.25)  (69 unrouted)
  Top 0.406: 249.86,291.46 250.07,291.51 | 199.31,224.51 199.22,224.41 | 250.07,224.86 250.41,224.51 250.22,224.31 | R66.2 C30.- | C30.- 213.02,266.46 211.06,266.46 | 211.06,266.46 C29.2 | IC22.24 211.06,260.14 211.06,266.46 | C35.- 232.47,275.56 C34.2 232.37,270.36 R71.1 v234.06,262.51 C38.1 | C30.- v213.06,268.51 | 250.07,256.69 250.07,256.51 | 250.07,251.61 250.07,251.51 | 235.52,252.31 C37.1 | 250.07,261.56 250.07,261.51 | 203.53,224.51 204.06,224.51 | 212.53,224.51 212.06,224.51 | 221.53,224.51 221.06,224.51 | 230.53,224.51 230.06,224.51 | 225.47,287.66 X7.SH2 | 231.87,287.26 X7.SH1 | 218.72,291.11 arc-90 219.06,291.46 | DD5.1 DD5.18
  Top 0.813: IC22.24 211.09,255.01 | 211.09,255.01 IC22.1 | 211.09,255.01 218.72,255.01 IC22.7 218.72,249.81 C36.2 219.37,247.86 219.97,247.26 C27.2 226.31,246.01 C28.- 232.81,246.01 235.52,248.71 v235.52,250.36 235.52,252.31 | IC23.13 250.07,256.69 | IC23.11 250.07,251.61 | R61.A 203.53,224.51 | R62.A 212.53,224.51 | R63.A 221.53,224.51 | R60.A 230.53,224.51
  Top 1.27: 231.87,287.26 X7.5 225.47,287.66 X7.3 219.06,287.26 X7.SH3 218.72,291.11
  Top 2.184: 219.06,291.46 249.86,291.46 | 250.41,224.51 230.06,224.51 221.06,224.51 212.06,224.51 204.06,224.51 199.31,224.51 | 250.07,224.86 250.07,251.51 250.07,256.51 250.07,261.51 250.07,291.51 | X6.2@1 X6.2@2 X6.2
  Bottom 0.406: v213.06,268.51 212.65,268.51 X6.2 | 240.91,250.36 v235.52,250.36 arc-90 234.06,251.81 v234.06,262.51 | DD5.18 -37.36,12.17 C4.1 DD6.1 DD6.18 | DD2.29 -31.64,42.02 -23.38,31.86 DD3.16 -18.94,30.59 -15.77,43.29 DD3.24
  other vias: 197.06,283.51 215.06,287.51 245.07,274.81 201.06,254.51 197.06,243.51 245.07,264.51 201.06,266.51
  pour Bottom (isolate 0.813): 194.06,292.51 251.07,292.51 251.07,261.51 234.06,261.51 234.06,238.51 194.06,238.51
  pour Top (isolate 1.016): 194.06,292.51 251.07,292.51 251.07,261.51 234.06,261.51 234.06,238.51 194.06,238.51
  pour Top (isolate 0.254): -17.04,232.82 -4.04,232.82 -4.04,217.82 -17.04,217.82
KD0  (1 unrouted)
KD1  (1 unrouted)
KD2  (1 unrouted)
KD3  (1 unrouted)
KD4  (1 unrouted)
KJ0  (1 unrouted)
KJ1  (1 unrouted)
KJ2  (1 unrouted)
KJ3  (1 unrouted)
KJ4  (1 unrouted)
KJ5  (1 unrouted)
KJ6  (1 unrouted)
KJ7  (1 unrouted)
KJOY  (2 unrouted)
N$1
  Top 0.406: R65.1 220.16,244.51 233.06,244.51 236.62,248.06 236.62,250.21 238.02,251.61 IC23.4
N$2  (2 unrouted)
N$3  (3 unrouted)
N$4  (3 unrouted)
N$5  (1 unrouted)
N$6  (1 unrouted)
N$7  (1 unrouted)
N$8  (7 unrouted)
N$9  (1 unrouted)
N$10  (2 unrouted)
N$11  (1 unrouted)
N$13  (1 unrouted)
N$14  (5 unrouted)
N$15  (1 unrouted)
N$16  (2 unrouted)
N$17  (3 unrouted)
N$18  (1 unrouted)
N$19  (3 unrouted)
  Bottom 0.254: 206.06,233.51 R61.E
N$20  (via drill 0.6 pad 0.25)
  other vias: 216.16,264.96
N$21  (3 unrouted)
N$22  (1 unrouted)
N$23  (3 unrouted)
  Top 0.406: 217.6,234.51 R62.E
N$24  (via drill 0.6 pad 0.25)
  Top 0.406: IC22.17 219.99,257.96 v219.97,257.96 | v209.22,257.61 207.12,257.61 arc90 R67.2
  Bottom 0.406: v219.97,257.96 arc-90 219.62,257.61 v209.22,257.61
N$25  (1 unrouted)
N$26  (2 unrouted)
N$27  (1 unrouted)
N$28  (1 unrouted)
N$29  (2 unrouted)
N$30  (2 unrouted)
N$31  (1 unrouted)
N$32  (5 unrouted)
N$33  (5 unrouted)
N$34  (3 unrouted)
N$35  (5 unrouted)
N$36  (2 unrouted)
N$37  (3 unrouted)
N$38  (3 unrouted)
N$39  (2 unrouted)
N$40  (3 unrouted)
N$41  (1 unrouted)
N$42  (3 unrouted)
  Bottom 0.254: R63.E 223.19,234.38 200.56,234.38 198.44,236.51
N$43  (via drill 0.6)  (3 unrouted)
  Top 0.406: v201.06,226.51 201.06,231.51 200.06,232.51
  Bottom 0.406: R60.E 238.06,228.51 238.06,226.51 v201.06,226.51
N$44  (6 unrouted)
N$45  (1 unrouted)
N$46  (2 unrouted)
N$47  (1 unrouted)
N$48  (2 unrouted)
N$49  (1 unrouted)
N$50  (2 unrouted)
N$51  (2 unrouted)
N$52
  Top 0.406: C26.1 R61.S
N$53  (1 unrouted)
N$54
  Top 0.406: C25.1 R62.S
N$55
  Top 0.406: C24.1 214.91,244.66 223.53,236.05 R63.S
N$56
  Top 0.406: IC22.3 213.63,251.08 212.72,250.16 C25.2
N$57
  Top 0.406: IC22.2 212.37,251.61 C26.2
N$58
  Top 0.406: IC22.4 C24.2
N$59
  Top 0.406: 235.94,259.23 arc-90 C38.2
  Top 0.813: IC23.1 235.94,259.23 | C38.2 231.5,259.66 arc90 Q3.1
  Bottom 0.406: R64.2 IC23.1
N$60
  Top 0.406: 238.71,254.26 IC23.3
  Top 0.813: 238.71,254.26 C37.2 231.9,254.26 arc-90 Q3.2 | IC23.3 IC23.2
  Bottom 0.406: R64.1 IC23.2
N$61  (via drill 0.6 pad 0.41)
  Top 0.406: IC22.10 222.53,251.05 223.16,250.41 v223.16,248.91
  Bottom 0.406: v223.16,248.91 223.16,245.95 R60.S
N$62  (4 unrouted)
N$63
  Top 0.406: IC22.6 217.44,245.31 R65.2
N$64  (via drill 0.6 pad 0.25)
  Top 0.406: IC22.20 v216.18,264.95 v216.16,264.96 | v216.16,267.96 216.22,267.96 R68.2
  Bottom 0.406: v216.16,264.96 v216.16,267.96
N$65
  Top 0.406: IC22.9 C36.1
N$66
  Top 0.406: IC22.18 R66.1
N$67
  Top 0.406: IC22.16 R69.2
N$68
  Top 0.406: IC22.15 222.53,264.97 R70.2
N$69
  Top 0.813: R68.1 C33.+
N$70
  Top 0.406: 225.77,275.21 C32.+
  Top 0.813: R69.1 223.66,273.11 225.77,275.21
N$71  (via drill 0.6 pad 0.25)
  Top 0.406: R70.1 v225.81,268.41 | v235.97,268.41 239.07,268.41 C31.+
  Bottom 0.406: v225.81,268.41 v235.97,268.41
N$72
  Top 0.406: IC22.14 223.8,263.24 228.06,267.51 228.06,273.91 C35.+
N$73
  Top 0.406: C34.1 230.56,266.66 R71.2 230.41,266.51 230.06,266.51 225.06,261.51 IC22.13
N$74  (via drill 0.6 pad 0.25)
  other vias: 216.16,267.96
N$75
  Top 0.813: C33.- X6.1
N$76
  Bottom 0.406: 0.75,226.81 6.46,217.28 0.75,217.28 6.46,226.81
N$78
  Top 0.813: C32.- 222.06,279.36 X7.6
N$79
  Top 0.813: C31.- 231.97,281.76 X7.8
N$80  (via drill 0.6 pad 0.25)
  other vias: 213.12,262.01
N$81  (via drill 0.6 pad 0.25)
  other vias: 208.52,261.91
N$82  (via drill 0.6 pad 0.25)
  other vias: 217.47,262.01
N$83  (via drill 0.6 pad 0.25)
  other vias: 213.06,268.51
N$84  (via drill 0.6 pad 0.25)
  other vias: 225.81,268.41
N$85  (via drill 0.6 pad 0.25)
  other vias: 235.97,268.36
N$86  (via drill 0.6 pad 0.25)
  other vias: 220.02,257.96
N$87  (via drill 0.6 pad 0.25)
  other vias: 209.16,257.61
N$88  (via drill 0.6)
  other vias: 234.06,262.51
N$89  (via drill 0.6)
  other vias: 233.22,248.86
N$90  (via drill 0.6)
  other vias: 223.16,248.91
N$91  (via drill 0.6 pad 2.18)
  other vias: -7.34,198.37
N$92  (1 unrouted)
N$93  (1 unrouted)
N$94  (1 unrouted)
N$95  (1 unrouted)
N$96  (1 unrouted)
N$97  (1 unrouted)
N$98  (1 unrouted)
N$99  (1 unrouted)
N$100  (2 unrouted)
N$126  (2 unrouted)
N$127  (1 unrouted)
N$128  (1 unrouted)
N$129  (1 unrouted)
N$130  (1 unrouted)
PBANK  (1 unrouted)
R  (3 unrouted)
R_INT  (1 unrouted)
RAS_RAM
  Bottom 0.406: DD6.5 -31.64,1.38 | -31.64,1.38 -34.81,1.38 | -34.81,1.38 -36.72,1.38 -38.62,0.11 -43.7,0.11 DD5.5 | R23.1 -34.81,1.38 | C4.2 -31.64,1.38
RES  (3 unrouted)
SL  (2 unrouted)
SOUND-IN  (1 unrouted)
SR  (2 unrouted)
SYNC  (2 unrouted)
TAPE_IN
  Bottom 0.406: DD4.19 28.68,10.9 TI.2
TAPE_OUT
  Bottom 0.406: DD4.13 30.59,4.55 TO.2
VCC  (13 unrouted)
Y  (7 unrouted)

## Text on the board
Top: джои | звук ay
tNames: 9 | 8 | 7 | 6 | 5 | 4 | 3 | 2 | 1 | Audio Out | + | e | e | k | k | b | b | b | b | e | e | k | k | + | + | T1-T4 - KT503 | CXA1645 / not R67 | + | CXA2075 / not R66 R71 C36 C34 C35 | + | CXA1645M | + | R | G | B | S | CARTRIDGE SLOT | + | 1 | 2 | 3 | JP1 | 1-2 27C010 | 2-3 27C256/512 | 5V-0.5A | ALF-02 | by Dmitry Pugachev and Sergey Bagan aka Prusak | IC11 - plastic/keramika / R23 - 33/0 om / C4 - 33/100 pF | JOY-1 | 9 | 1 | 10 | 2 | + | + | + | JOY-2 | + | +
201bmp: G:/Platform/Ýëüô/alf0.bmp